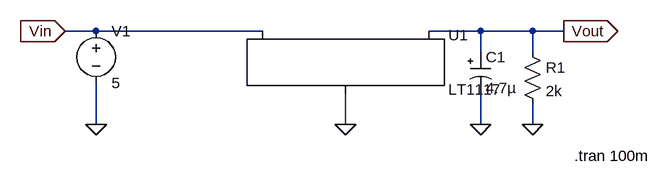
[diagram p0: schematic 3V3 Voltage Regulator.asc]
3V3 Voltage Regulator.asc, the LTspice schematic file:
Version 4
SHEET 1 880 680
WIRE -144 144 -192 144
WIRE 112 144 -144 144
WIRE 448 144 368 144
WIRE 528 144 448 144
WIRE 576 144 528 144
WIRE 448 176 448 144
WIRE 528 176 528 144
WIRE -144 288 -144 224
WIRE 240 288 240 240
WIRE 448 288 448 240
WIRE 528 288 528 256
FLAG -144 288 0
FLAG 240 288 0
FLAG 448 288 0
FLAG 528 288 0
FLAG 576 144 Vout
IOPIN 576 144 Out
FLAG -192 144 Vin
IOPIN -192 144 In
SYMBOL PowerProducts\\LT1117 240 144 R0
SYMATTR InstName U1
SYMBOL voltage -144 128 R0
WINDOW 123 0 0 Left 0
WINDOW 39 0 0 Left 0
SYMATTR InstName V1
SYMATTR Value 5
SYMBOL polcap 432 176 R0
SYMATTR InstName C1
SYMATTR Value 4.7µ
SYMBOL res 512 160 R0
SYMATTR InstName R1
SYMATTR Value 2k
TEXT 592 336 Left 2 !.tran 100m

The netlist it stands for:
* 3V3 Voltage Regulator.asc
XU1 0 Vout Vin LT1117
V1 Vin 0 5
C1 Vout 0 4.7µ
R1 Vout 0 2k
.tran 100m
.lib LT1117.lib
.backanno
.end